# EAGLE schematic BNC-V004 (EAGLE 6.5.0)
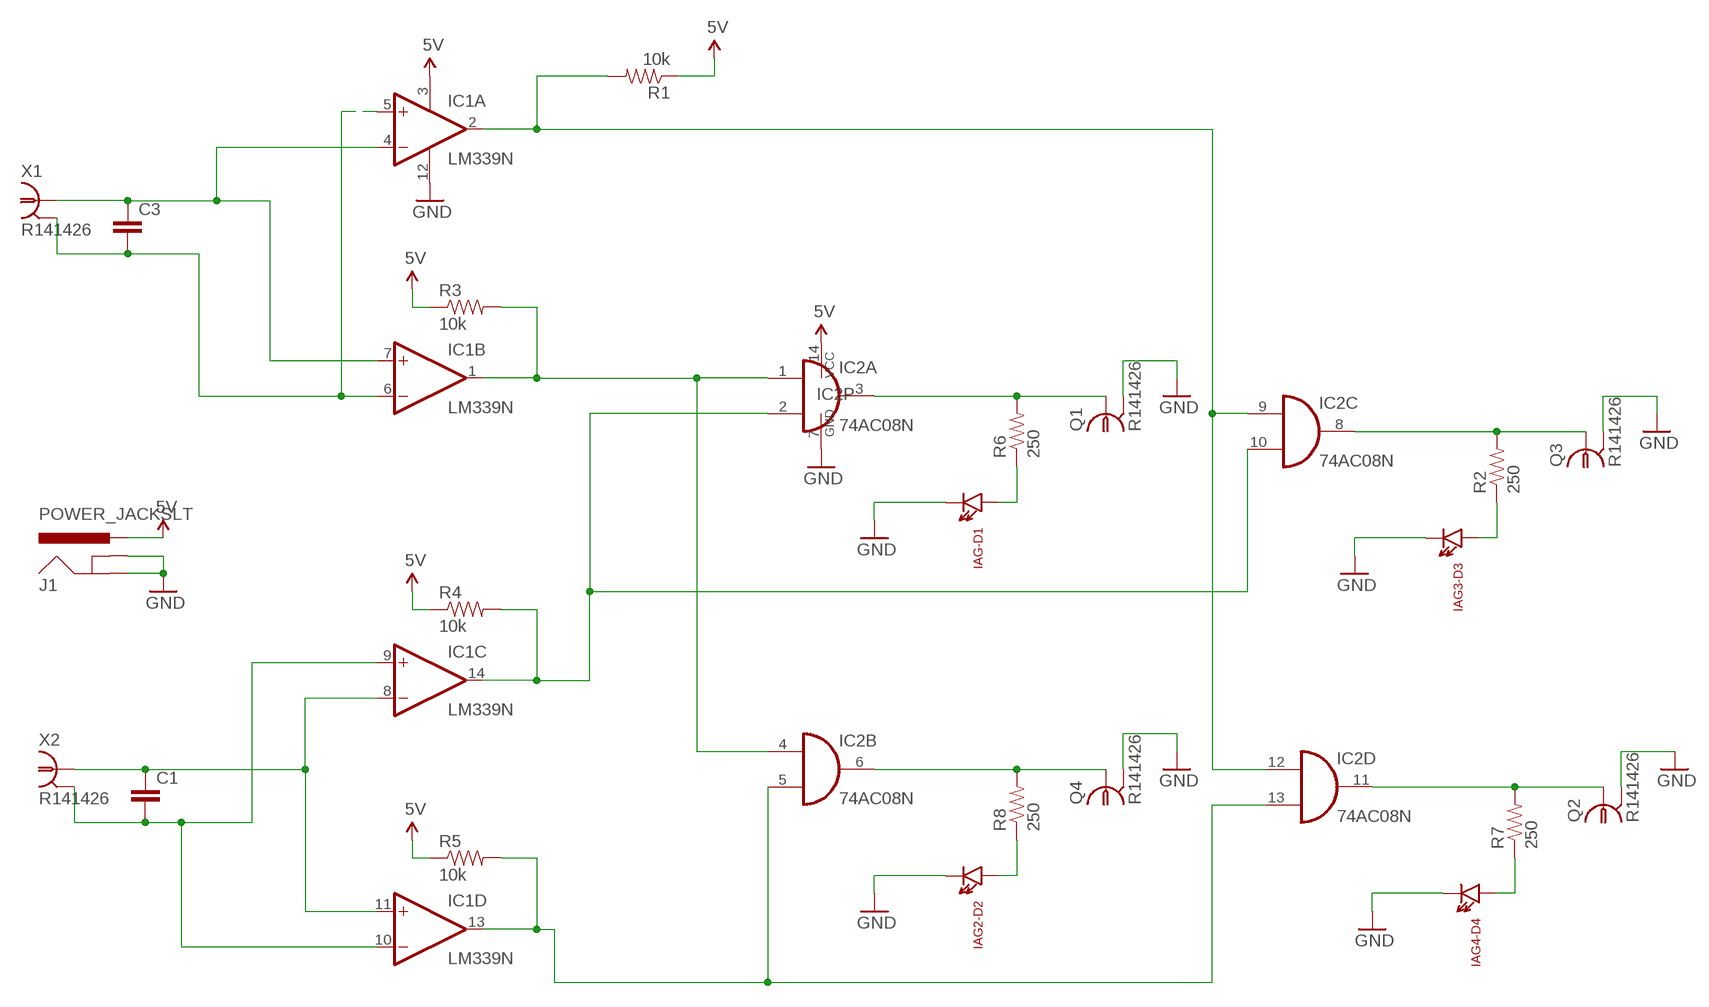
[diagram p0: schematic, sheet 1]

## Parts
C1  0.1UF-50V-20%(PTH)KIT-EZ  [CAP-PTH-SMALL-KIT]
C3  0.1UF-50V-20%(PTH)KIT-EZ  [CAP-PTH-SMALL-KIT]
IAG2-D2  LTE-302  [LTE-302]
IAG3-D3  LTE-302  [LTE-302]
IAG4-D4  LTE-302  [LTE-302]
IAG-D1  LTE-302  [LTE-302]
IC1  LM339N  [DIL14]
IC2  74AC08N  [DIL14]
J1  POWER_JACKSLT  [POWER_JACK_SLOT]
Q1  R141426  [R141426]
Q2  R141426  [R141426]
Q3  R141426  [R141426]
Q4  R141426  [R141426]
R1  10k  10KOHM-1/4W-1%(PTH)HORIZ  [AXIAL-0.3]
R2  250  1KOHM-1/4W-1%(PTH)  [AXIAL-0.3]
R3  10k  10KOHM-1/4W-1%(PTH)HORIZ  [AXIAL-0.3]
R4  10k  10KOHM-1/4W-1%(PTH)HORIZ  [AXIAL-0.3]
R5  10k  10KOHM-1/4W-1%(PTH)HORIZ  [AXIAL-0.3]
R6  250  1KOHM-1/4W-1%(PTH)  [AXIAL-0.3]
R7  250  1KOHM-1/4W-1%(PTH)  [AXIAL-0.3]
R8  250  1KOHM-1/4W-1%(PTH)  [AXIAL-0.3]
X1  R141426  [R141426]
X2  R141426  [R141426]

## Nets
5V: IC1.3(P:V+) IC2.14(P:VCC) J1.PWR R1.P$1 R3.P$1 R4.P$1 R5.P$1
GND: IAG2-D2.C IAG3-D3.C IAG4-D4.C IAG-D1.C IC1.12(P:GND) IC2.7(P:GND) J1.GND@1(GNDBREAK) J1.GND@2(GND) Q1.2 Q1.3 Q1.4 Q1.5 Q2.2 Q2.3 Q2.4 Q2.5 Q3.2 Q3.3 Q3.4 Q3.5 Q4.2 Q4.3 Q4.4 Q4.5
N$1: IC1.2(A:OUT) IC2.9(C:I0) IC2.12(D:I0) R1.P$2
N$2: IC2.11(D:O) Q2.1 R7.P$2
N$3: IAG4-D4.A R7.P$1
N$4: IC1.1(B:OUT) IC2.1(A:I0) IC2.4(B:I0) R3.P$2
N$5: IC1.14(C:OUT) IC2.2(A:I1) IC2.10(C:I1) R4.P$2
N$6: IC1.13(D:OUT) IC2.5(B:I1) IC2.13(D:I1) R5.P$2
N$7: C3.2 IC1.5(A:+IN) IC1.6(B:-IN) X1.2 X1.3 X1.4 X1.5
N$8: C3.1 IC1.4(A:-IN) IC1.7(B:+IN) X1.1
N$9: C1.1 IC1.8(C:-IN) IC1.11(D:+IN) X2.1
N$11: C1.2 IC1.9(C:+IN) IC1.10(D:-IN) X2.2 X2.3 X2.4 X2.5
N$12: IC2.8(C:O) Q3.1 R2.P$2
N$13: IAG3-D3.A R2.P$1
N$14: IC2.6(B:O) Q4.1 R8.P$2
N$15: IAG2-D2.A R8.P$1
N$16: IC2.3(A:O) Q1.1 R6.P$2
N$17: IAG-D1.A R6.P$1

## Library data of the parts
C1 C3 = SparkFun-Capacitors:0.1UF-50V-20%(PTH): CAP-08370; PROD_ID: CAP-08370
IAG2-D2 IAG3-D3 IAG4-D4 IAG-D1 = SparkFun-LED:LTE-302: Through-hole side-firing 940nm IR LED
IC1 = linear:LM339: Low Power Low Offset Voltage Quad Comparators with open collector; LM139/LM239/LM339/LM2901/LM3302
IC2 = 74xx-eu:74*08: Quad 2-input AND gate
J1 = SparkFun-Connectors:POWER_JACK: Power Jack This is the standard 5.5mm barrel jack for power. The PTH is the most common, proven, reliable, footprint. The Slot footprint only works if the mill layer is transmitted to the PCB fab house so be warned. Mating wall wart : TOL-00298 (and others); PROD_ID: PRT-00119
Q1-Q4 X1 X2 = con-coax:R141426: BNC COAX CONNECTOR Radiall 50/75 Ohm Spoerle; MF: FARNELL; MPN: R141426161; OC_FARNELL: 4195115; OC_NEWARK: 14J7919
R1 R3-R5 = SparkFun-Resistors:10KOHM-1/4W-1%(PTH): RES-12183; PROD_ID: RES-12183
R2 R6-R8 = SparkFun-Resistors:1KOHM-1/4W-1%(PTH): RES-12182; PROD_ID: RES-12182; VALUE: 1K